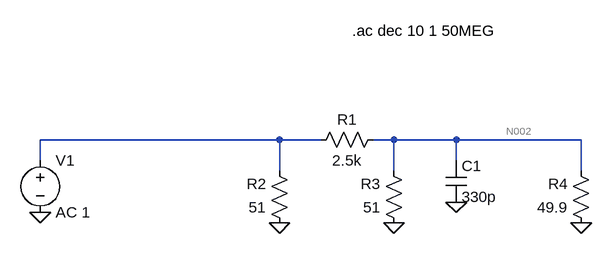
[diagram p0: schematic Draft1.asc]
Draft1.asc, the LTspice schematic file:
Version 4
SHEET 1 880 680
WIRE 112 144 -256 144
WIRE 176 144 112 144
WIRE 288 144 256 144
WIRE 384 144 288 144
WIRE 576 144 384 144
WIRE -256 176 -256 144
WIRE 384 176 384 144
WIRE 112 192 112 144
WIRE 288 192 288 144
WIRE 576 192 576 144
FLAG -256 256 0
FLAG 112 272 0
FLAG 288 272 0
FLAG 576 272 0
FLAG 384 240 0
SYMBOL res 272 128 R90
WINDOW 0 0 56 VBottom 2
WINDOW 3 32 56 VTop 2
SYMATTR InstName R1
SYMATTR Value 2.5k
SYMBOL res 128 288 R180
WINDOW 0 36 76 Left 2
WINDOW 3 36 40 Left 2
SYMATTR InstName R2
SYMATTR Value 51
SYMBOL res 304 288 R180
WINDOW 0 36 76 Left 2
WINDOW 3 36 40 Left 2
SYMATTR InstName R3
SYMATTR Value 51
SYMBOL res 592 288 R180
WINDOW 0 36 76 Left 2
WINDOW 3 36 40 Left 2
SYMATTR InstName R4
SYMATTR Value 49.9
SYMBOL voltage -256 160 R0
WINDOW 123 0 0 Left 0
WINDOW 39 0 0 Left 0
SYMATTR InstName V1
SYMATTR Value AC 1
SYMBOL cap 368 176 R0
SYMATTR InstName C1
SYMATTR Value 330p
TEXT 224 -24 Left 2 !.ac dec 10 1 50MEG

The netlist it stands for:
* Draft1.asc
R1 N002 N001 2.5k
R2 0 N001 51
R3 0 N002 51
R4 0 N002 49.9
V1 N001 0 AC 1
C1 N002 0 330p
.ac dec 10 1 50MEG
.backanno
.end

* Results of the author's LTspice run, read from the files saved beside the schematic
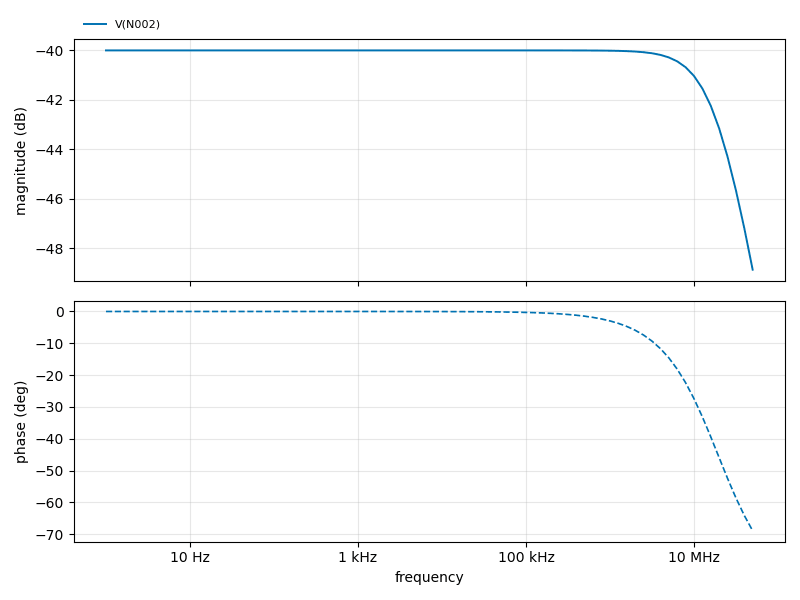
[diagram p1: AC Analysis of Draft1.asc, plotted from the saved traces]
* AC Analysis, 1 run:
*   V(N002): -40.01 dB at 1 Hz, -48.88 dB at 50 MHz, peak -40.01 dB at 1 Hz, 3 dB below the peak at 19.25 MHz